# EAGLE design dual supply (EAGLE 9.6.2)
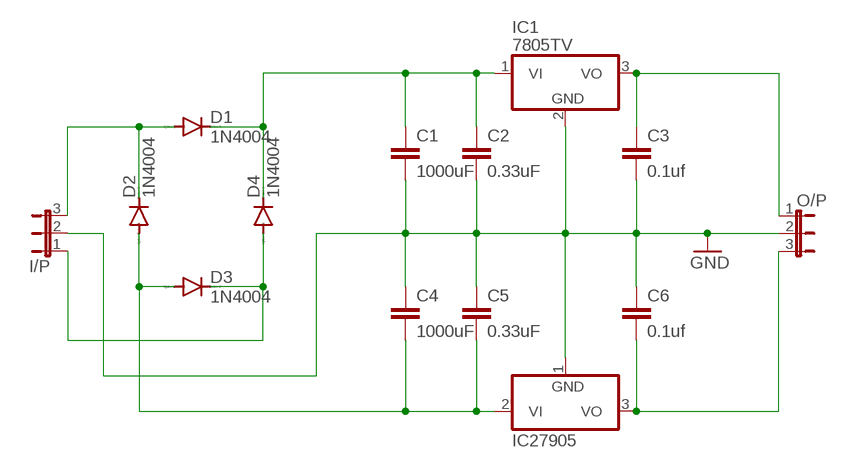
[diagram p0: schematic, sheet 1]

## Parts
C1  1000uF  C2,5-3  [C2.5-3]
C2  0.33uF  C2,5-3  [C2.5-3]
C3  0.1uf  C2,5-3  [C2.5-3]
C4  1000uF  C2,5-3  [C2.5-3]
C5  0.33uF  C2,5-3  [C2.5-3]
C6  0.1uf  C2,5-3  [C2.5-3]
D1  1N4004  [DO41-10]
D2  1N4004  [DO41-10]
D3  1N4004  [DO41-10]
D4  1N4004  [DO41-10]
I/P  JP2E  [JP2]
IC1  7805TV  [TO220V]
IC27905  7905T  [TO220H]
O/P  JP2E  [JP2]

## Nets
GND: C1.2 C2.2 C3.2 C4.1 C5.1 C6.1 I/P.2 IC1.2(GND) IC27905.1(GND) O/P.2
N$1: D1.A D2.C I/P.3
N$2: C1.1 C2.1 D1.C D4.C IC1.1(VI)
N$3: D3.C D4.A I/P.1
N$4: C4.2 C5.2 D2.A D3.A IC27905.2(VI)
N$8: C3.1 IC1.3(VO) O/P.1
N$9: C6.2 IC27905.3(VO) O/P.3

## Library data of the parts
C1-C6 = capacitor-wima:C: CAPACITOR naming: grid - package width
D1-D4 = diode:1N4004: DIODE general purpose rectifier, 1 A
I/P O/P = jumper:JP2E: JUMPER
IC1 = linear:78*: Positive VOLTAGE REGULATOR Source: http://cache.national.com/ds/LM/LM78L05.pdf http://www.fairchildsemi.com/ds/LM/LM7805.pdf
IC27905 = linear:79*: Negative VOLTAGE REGULATOR

## Board
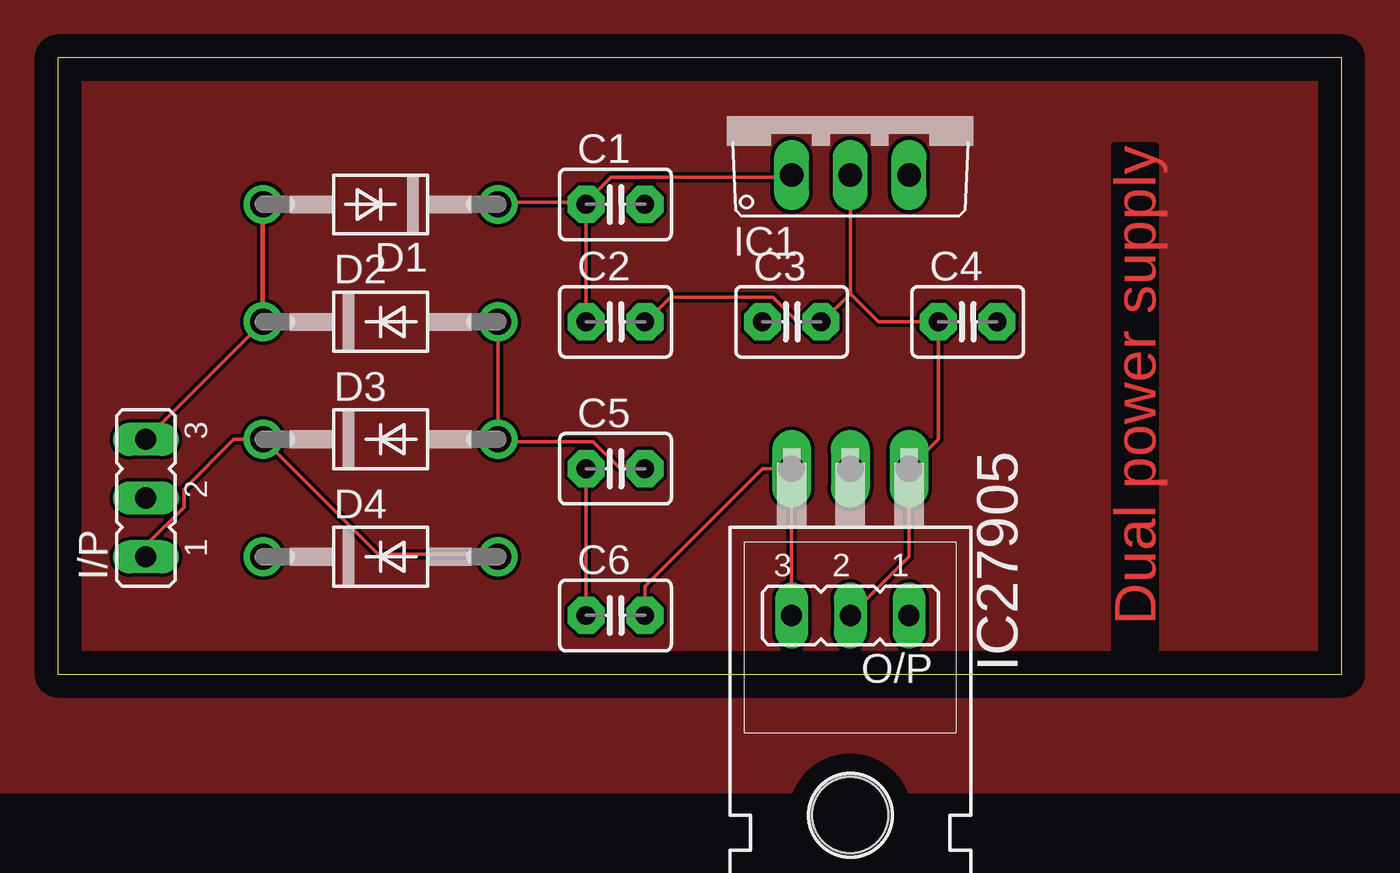
[diagram p1: board, top side]
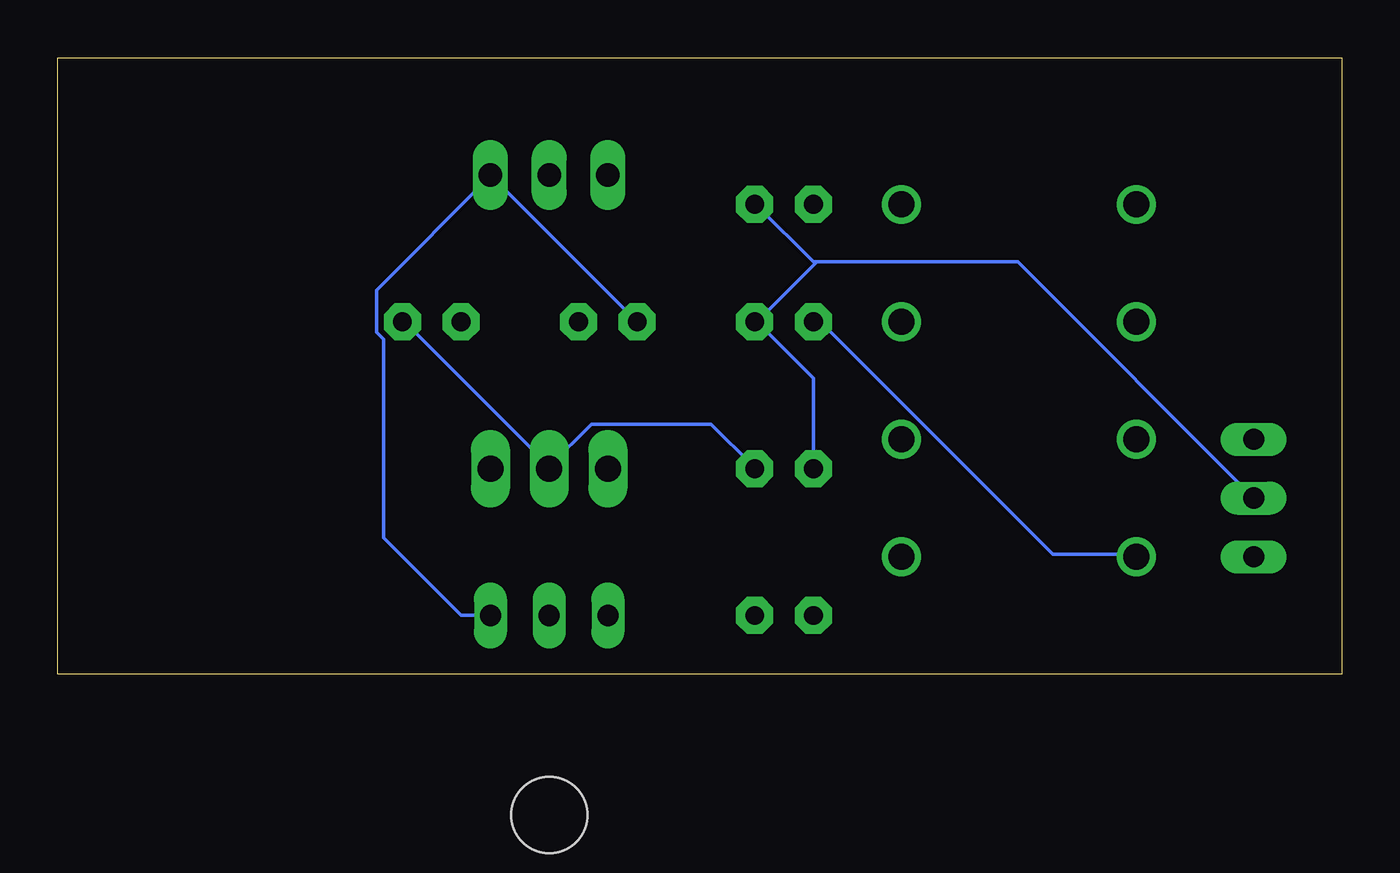
[diagram p2: board, bottom side, seen from below]

Size 55.55 x 26.66 mm. Coordinates in mm from the lower left corner, seen from the top.
Outline: 0,0 55.55,0 55.55,26.66 0,26.66 0,0
Copper layers (1*16): Top 0.035mm / dielectric 1.5mm / Bottom 0.035mm
Design rules "default": minimum track width 6mil, minimum drill 0.35mm, track to track 6mil, track to pad 6mil, pad to pad 6mil, via to via 6mil, smd to smd 6mil, copper to edge 40mil, drill to drill 6mil, minimum pad ring 10mil, minimum via ring 8mil, stop-mask expansion 4mil, vias tented up to drill 0mil, thermal gap 10mil

### Footprints (pad centres in the part's own frame; a part is rotated, then mirrored left to right if it is on the bottom)
C2.5-3 = drill 0.813 pad 1.6 octagon: 1 -1.27,0; 2 1.27,0
DO41-10 = drill 1.118: A 5.08,0; C -5.08,0
JP2 = drill 0.914 long: 1 -2.54,0; 2 0,0; 3 2.54,0
TO220V = drill 1.016 long: 1 -2.54,-2.54; 2 0,-2.54; 3 2.54,-2.54
TO220H = drill 1.118 long: 1 -2.54,-10.16; 2 0,-10.16; 3 2.54,-10.16 | hole 3.302: 0,4.826

### Placement (x,y rotation side)
C1  24.13,20.32 0 top
C2  24.13,15.24 0 top
C3  31.75,15.24 0 top
C4  39.37,15.24 0 top
C5  24.13,8.89 0 top
C6  24.13,2.54 0 top
D1  13.97,20.32 180 top
D2  13.97,15.24 0 top
D3  13.97,10.16 0 top
D4  13.97,5.08 0 top
I/P  3.81,7.62 90 top
IC1  34.29,24.13 0 top
IC27905  34.29,-1.27 180 top
O/P  34.29,2.54 180 top

### Tracks (layer width: path | path; a pad name or v marks a point on that pad's centre or on a via)
GND
  Top 0.152: 34.29,16.46 IC1.2 | 34.29,16.46 33.07,15.24 C3.2 32,15.24 30.94,16.31 26.52,16.31 25.45,15.24 C2.2 | 34.29,16.46 35.51,15.24 C4.1 38.1,10.16 IC27905.1 36.83,5.08 O/P.2 | C6.1 C5.1
  Bottom 0.152: 22.71,17.83 22.86,17.83 25.3,20.27 C1.2 | 22.71,17.83 14.02,17.83 I/P.2 | 22.71,17.83 25.3,15.24 | C5.1 22.86,12.8 25.3,15.24 | 25.3,15.24 C2.2
N$1
  Top 0.152: D2.C D1.A 8.84,20.27 8.84,15.24 D2.C | D2.C I/P.3
N$2
  Top 0.152: 22.86,20.42 23.93,21.49 31.7,21.49 IC1.1 | C2.1 C1.1 22.86,20.42 | 22.86,20.42 19.05,20.42 D1.C
  Bottom 0.152: C2.1 22.55,15.24 12.5,5.18 8.99,5.18 D4.C
N$3
  Top 0.152: D4.A 19.05,5.18 13.87,5.18 D3.C 7.62,10.16 5.46,8 5.46,7.23 3.81,5.58 I/P.1
N$4
  Top 0.152: C5.2 25.3,8.99 24.23,8.99 23.16,10.06 19.05,10.06 D3.A D2.A
  Bottom 0.152: 34.29,8.99 40.54,15.24 C4.2 | 34.29,8.99 32.46,10.82 27.28,10.82 25.45,8.99 C5.2 | 34.29,8.99 IC27905.2
N$8
  Bottom 0.152: C3.1 IC1.3 36.88,21.49 41.76,16.61 41.76,14.78 41.45,14.48 41.45,5.89 38.1,2.54 O/P.1
N$9
  Top 0.152: C6.2 25.4,3.81 30.48,8.89 IC27905.3 O/P.3
TOP
  pour Top: -5.08,33.02 59.69,33.02 59.69,-5.08 -5.08,-5.08

### Text on the board
Top: Dual power supply